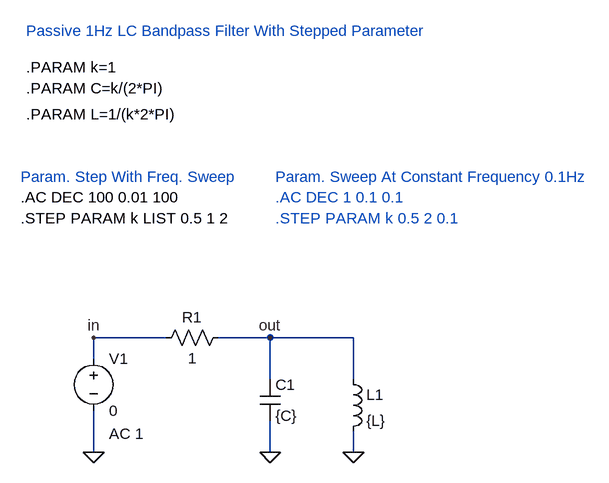
[diagram p0: schematic Passive_L&C.asc]
Passive_L&C.asc, the LTspice schematic file:
Version 4
SHEET 1 880 680
WIRE 128 176 208 176
WIRE 336 176 336 240
WIRE 208 240 208 176
WIRE 208 176 336 176
WIRE 208 304 208 352
WIRE 336 320 336 352
WIRE 48 176 -64 176
WIRE -64 208 -64 176
WIRE -64 288 -64 352
FLAG 208 352 0
FLAG 336 352 0
FLAG -64 352 0
FLAG -64 176 in
FLAG 208 176 out
SYMBOL res 32 192 R270
WINDOW 0 32 56 VTop 0
WINDOW 3 0 56 VBottom 0
SYMATTR InstName R1
SYMATTR Value 1
SYMBOL cap 192 240 R0
SYMATTR InstName C1
SYMATTR Value {C}
SYMBOL ind 320 224 R0
SYMATTR InstName L1
SYMATTR Value {L}
SYMBOL voltage -64 192 R0
WINDOW 123 24 132 Left 0
WINDOW 39 0 0 Left 0
SYMATTR InstName V1
SYMATTR Value 0
SYMATTR Value2 AC 1
TEXT -168 -240 Left 0 !.PARAM k=1
TEXT -168 -208 Left 0 !.PARAM C=k/(2*PI)
TEXT -168 -168 Left 0 !.PARAM L=1/(k*2*PI)
TEXT -176 -40 Left 0 !.AC DEC 100 0.01 100
TEXT -176 -8 Left 0 !.STEP PARAM k LIST 0.5 1 2
TEXT -168 -296 Left 0 ;Passive 1Hz LC Bandpass Filter With Stepped Parameter
TEXT 216 -8 Left 0 ;.STEP PARAM k 0.5 2 0.1
TEXT 216 -40 Left 0 ;.AC DEC 1 0.1 0.1
TEXT 216 -72 Left 0 ;Param. Sweep At Constant Frequency 0.1Hz
TEXT -176 -72 Left 0 ;Param. Step With Freq. Sweep

The netlist it stands for:
* Passive_L&C.asc
R1 in out 1
C1 out 0 {C}
L1 out 0 {L}
V1 in 0 0 AC 1
.PARAM k=1
.PARAM C=k/(2*PI)
.PARAM L=1/(k*2*PI)
.AC DEC 100 0.01 100
.STEP PARAM k LIST 0.5 1 2
* Passive 1Hz LC Bandpass Filter With Stepped Parameter
* .STEP PARAM k 0.5 2 0.1
* .AC DEC 1 0.1 0.1
* Param. Sweep At Constant Frequency 0.1Hz
* Param. Step With Freq. Sweep
.backanno
.end